# Altium project usb2uart.PrjPCB
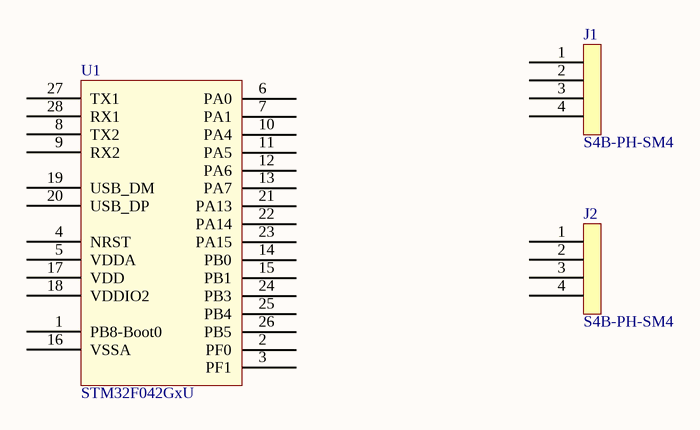
[diagram p0: usb2uart.SchDoc]
3 sheets, 12 parts. Net scope: global (net labels, ports and power ports of the same name join across sheets).
Sheets:
  usb2uart.SchDoc
  usb1uart.SchDoc
  pi-i2c.SchDoc

## Sheet usb2uart.SchDoc
size A4

### Parts
(Parts that share a designator on the sheet are numbered #1, #2 ... from top to bottom, then left to right.)
J1#1  S4B-PH-SM4  [S4B-PH-SM4]
J2#1  S4B-PH-SM4  [S4B-PH-SM4]
U1#1  STM32F042GxU  [UFQFPN28-4x4mm]

### Nets

Not connected (* = marked no-connect by the designer): J1#1 1 2 3 4; J2#1 1 2 3 4; U1#1 1(PB8-Boot0) 2(PF0) 3(PF1) 4(NRST) 5(VDDA) 6(PA0) 7(PA1) 8(TX2) 9(RX2) 10(PA4) 11(PA5) 12(PA6) 13(PA7) 14(PB0) 15(PB1) 16(VSSA) 17(VDD) 18(VDDIO2) 19(USB_DM) 20(USB_DP) 21(PA13) 22(PA14) 23(PA15) 24(PB3) 25(PB4) 26(PB5) 27(TX1) 28(RX1)

### Library data of the parts
U1#1 = STM32F042GxU: Imported; Vendor: STMicroelectronics; C: Copyright (C) 2016 Accelerated Designs. All rights reserved; Copyright: Copyright (C) 2016 Accelerated Designs. All rights reserved; Manufacturer_Part_Number: stm32f042gxu; Value: Value; Type: Type; RefDes: RefDes

## Sheet usb1uart.SchDoc
size A4
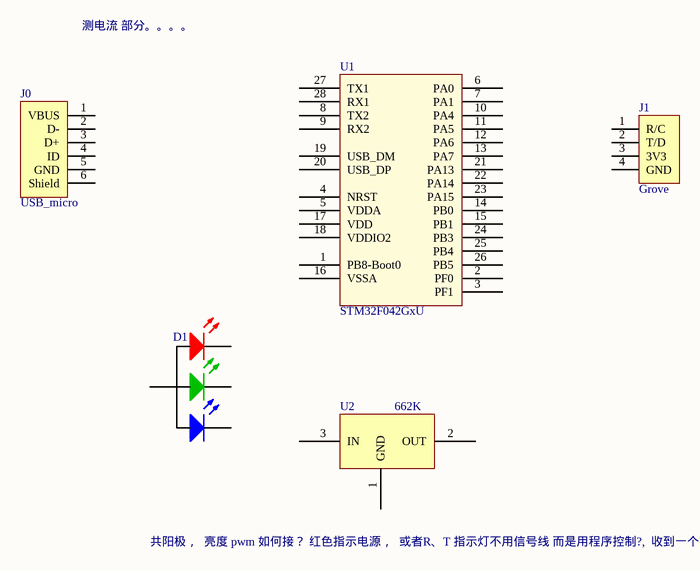
[diagram p1: usb1uart.SchDoc]

### Parts
(Parts that share a designator on the sheet are numbered #1, #2 ... from top to bottom, then left to right.)
D1#1  (no value)
J0  USB_micro  [USB_MICRO]
J1#2  Grove  [S4B-PH-SM4]
U1#2  STM32F042GxU
U2  662K  [SOT223]

### Nets

Not connected (* = marked no-connect by the designer): D1#1 1(A) 2(K); J0 1(VBUS) 2(D-) 3(D+) 4(ID) 5(GND) 6(Shield); J1#2 1(R/C) 2(T/D) 3(3V3) 4(GND); U1#2 1(PB8-Boot0) 2(PF0) 3(PF1) 4(NRST) 5(VDDA) 6(PA0) 7(PA1) 8(TX2) 9(RX2) 10(PA4) 11(PA5) 12(PA6) 13(PA7) 14(PB0) 15(PB1) 16(VSSA) 17(VDD) 18(VDDIO2) 19(USB_DM) 20(USB_DP) 21(PA13) 22(PA14) 23(PA15) 24(PB3) 25(PB4) 26(PB5) 27(TX1) 28(RX1); U2 1(GND) 2(OUT) 3(IN)

### Notes on the sheet
- 测电流 部分。。。。
- 共阳极，  亮度 pwm 如何接？ 红色指示电源，  或者R、T 指示灯不用信号线 而是用程序控制?,  收到一个字节闪一次，这样可以 精细控制

### Library data of the parts
D1#1 = LED-RGB-CA: common anode 共阳极

## Sheet pi-i2c.SchDoc
size A4
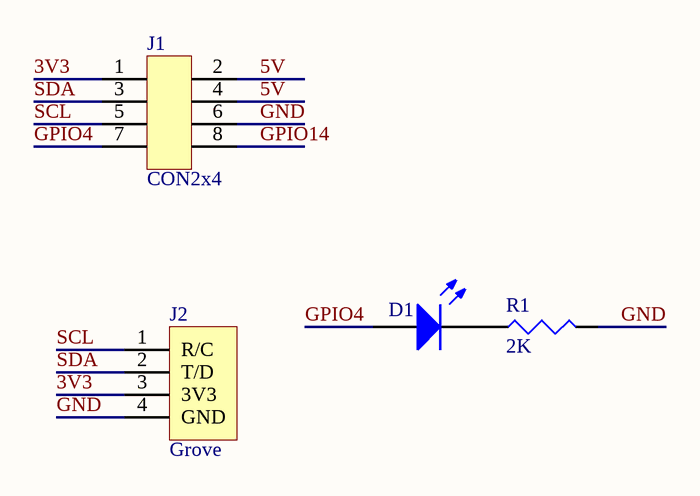
[diagram p2: pi-i2c.SchDoc]

### Parts
(Parts that share a designator on the sheet are numbered #1, #2 ... from top to bottom, then left to right.)
D1#2  (no value)
J1#3  CON2x4  [2x4P_SMT_2.54mm]
J2#2  Grove  [S4B-PH-SM4]
R1  2K  [0603_R]

### Nets
3V3: J1#3.1 J2#2.3(3V3)
5V: J1#3.2 J1#3.4
GND: J1#3.6 J2#2.4(GND) R1.2
GPIO4: D1#2.1(A) J1#3.7
GPIO14: J1#3.8
SCL: J1#3.5 J2#2.1(R/C)
SDA: J1#3.3 J2#2.2(T/D)
NetD1#2_2: D1#2.2(K) R1.1

### Library data of the parts
D1#2 = LED: Published: 8-Jun-2000; LatestRevisionDate: 08-Jul-2005; LatestRevisionNote: Mech Layer 1 removed.; PackageReference: LED-1; Publisher: Altium Limited; PackageDescription: LED; 2 Leads
R1 = Res: Published: 8-Jun-2000; LatestRevisionDate: 29-May-2009; LatestRevisionNote: IPC-7351 Footprint Added.; PackageReference: J1-0603; Publisher: Altium Limited; PackageDescription: Chip Resistor